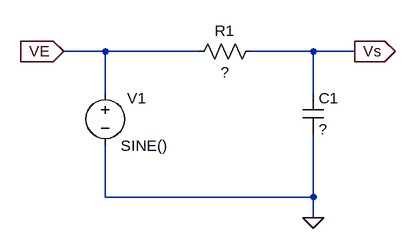
[diagram p0: schematic Filtre pour fonction de transfert.asc]
Filtre pour fonction de transfert.asc, the LTspice schematic file:
Version 4
SHEET 1 1748 680
WIRE 336 208 272 208
WIRE 480 208 336 208
WIRE 656 208 560 208
WIRE 720 208 656 208
WIRE 336 272 336 208
WIRE 656 272 656 208
WIRE 336 432 336 352
WIRE 656 432 656 336
WIRE 656 432 336 432
WIRE 656 464 656 432
FLAG 656 464 0
FLAG 720 208 Vs
IOPIN 720 208 Out
FLAG 272 208 VE
IOPIN 272 208 In
SYMBOL res 464 224 R270
WINDOW 0 32 56 VTop 2
WINDOW 3 0 56 VBottom 2
SYMATTR InstName R1
SYMATTR Value ?
SYMBOL cap 640 272 R0
SYMATTR InstName C1
SYMATTR Value ?
SYMBOL voltage 336 256 R0
WINDOW 3 24 97 Left 2
WINDOW 0 34 24 Left 2
SYMATTR Value SINE()
SYMATTR InstName V1
SYMATTR Value2 AC 1 0

The netlist it stands for:
* Filtre pour fonction de transfert.asc
R1 VE Vs ?
C1 Vs 0 ?
V1 VE 0 SINE() AC 1 0
.backanno
.end